# EAGLE design LED_Driver (EAGLE 7.2.0)
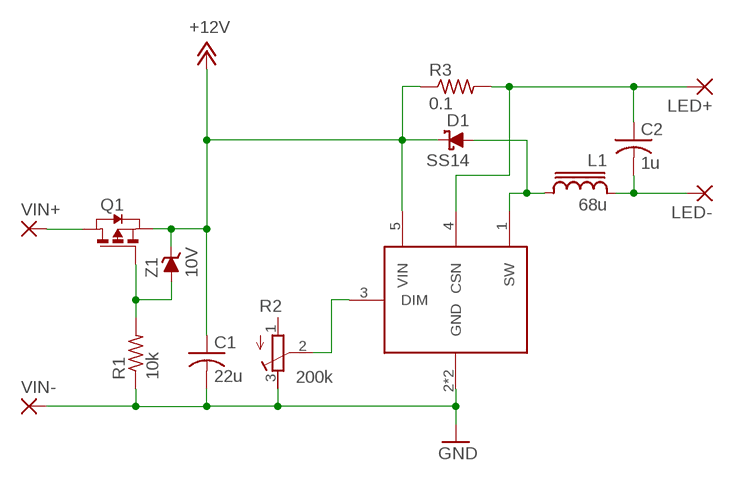
[diagram p0: schematic, sheet 1]

## Parts
C1  22u  C-USC1210K  [C1210K]
C2  1u  C-USC0805K  [C0805K]
D1  SS14  SCHOTTKYSCHOTTKY-DO214AC  [DO214AC]
IC1  PT4115  [SOT-89-5]
L1  68u  CDRH127/LD  [CDRH127/LD]
LED+  SMD2  [SMD1,27-2,54]
LED-  SMD2  [SMD1,27-2,54]
Q1  PMOSSOT23  [SOT-23]
R1  10k  R-US_R0805  [R0805]
R2  200k  R-TRIMM3296W  [RTRIM3296W]
R3  0.1  R-US_R2512  [R2512]
VIN+  SMD2  [SMD1,27-2,54]
VIN-  SMD2  [SMD1,27-2,54]
Z1  10V  ZENER  [SOD123]

## Nets
+12V: C1.1 D1.C IC1.5(VIN) Q1.2(S) R3.1 Z1.C
DIM: IC1.3(DIM) R2.2(S)
GND: C1.2 IC1.2(GND) IC1.EX(GND) R1.1 R2.3(E) VIN-.1(P)
N$1: C2.1 IC1.4(CSN) LED+.1(P) R3.2
N$2: D1.A IC1.1(SW) L1.2
N$3: Q1.1(D) VIN+.1(P)
N$4: C2.2 L1.1 LED-.1(P)
N$8: Q1.3(G) R1.2 Z1.A
Unconnected: R2.1(A)

## Library data of the parts
C1 C2 = resistor:C-US: CAPACITOR, American symbol
D1 = diode:SCHOTTKY
IC1 = IC:PT4115
L1 = Inductor:CDRH127/LD
LED+ LED- VIN+ VIN- = wirepad:SMD2: SMD PAD
Q1 = zetex:PMOSSOT23: MOS FET; OC_FARNELL: unknown; OC_NEWARK: unknown
R1 R3 = resistor:R-US_: RESISTOR, American symbol
R2 = rcl:R-TRIMM: Trimm resistor
Z1 = diode:ZENER

## Board
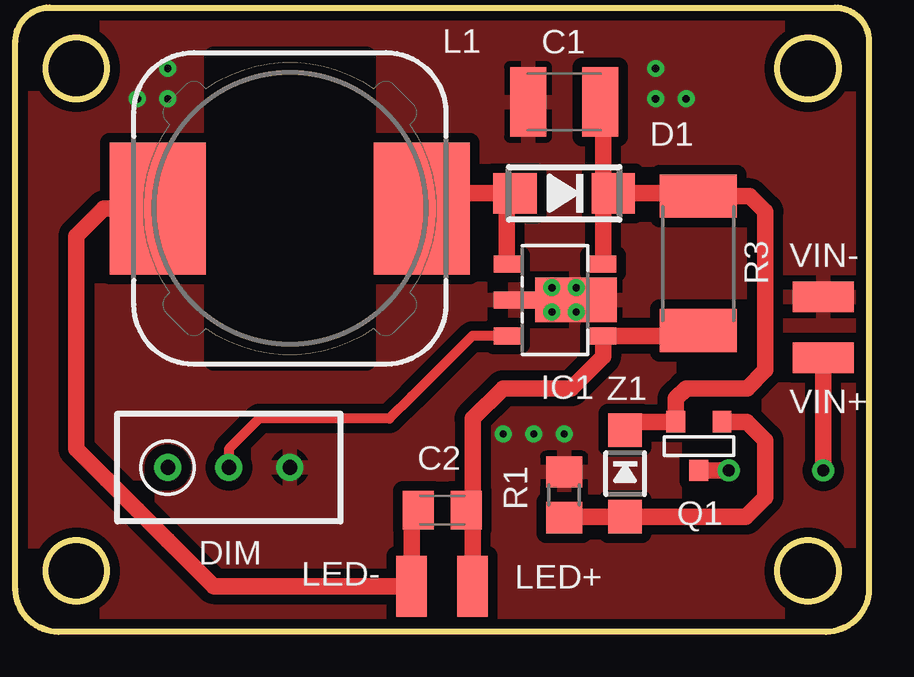
[diagram p1: board, top side]
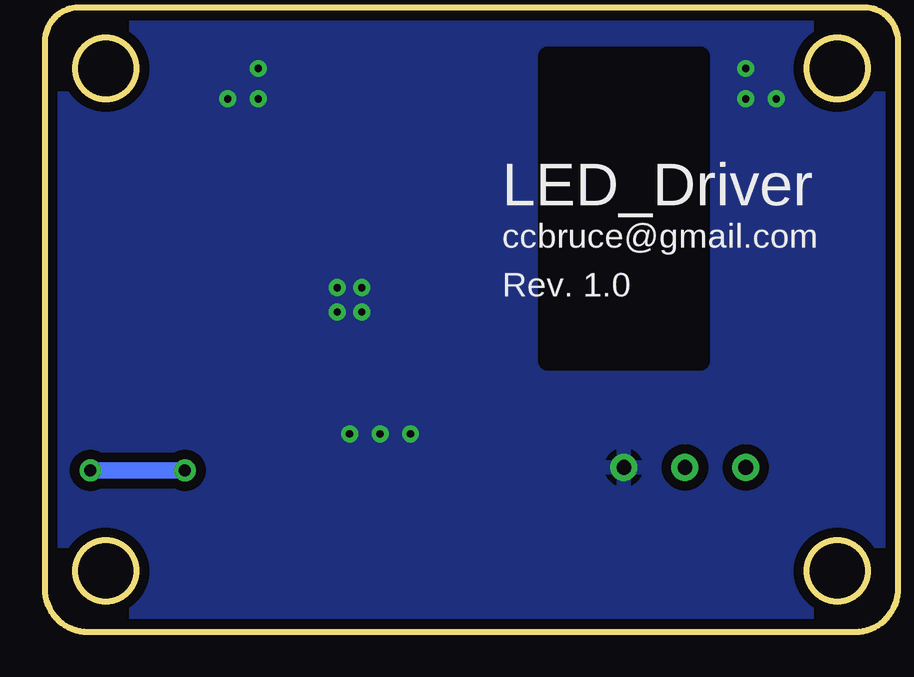
[diagram p2: board, bottom side, seen from below]

No outline drawn. Coordinates in mm, seen from the top.
Copper layers (1*16): Top 0.035mm / dielectric 1.5mm / Bottom 0.035mm
Design rules "default *": minimum track width 10mil, minimum drill 24mil, track to track 8mil, track to pad 8mil, pad to pad 8mil, via to via 8mil, smd to smd 8mil, copper to edge 40mil, drill to drill 8mil, minimum pad ring 10mil, minimum via ring 8mil, stop-mask expansion 4mil, vias tented up to drill 0.5mm, thermal gap 10mil
tRestrict: area 1.3,22.2 to 3.8,24.8; area 31.8,22.2 to 34.3,24.8; area 1.3,1.3 to 3.8,3.8; area 31.8,1.3 to 34.3,3.8; area 8.3,11.3 to 14.6,24; 8 lines
bRestrict: area 1.3,22.2 to 3.8,24.8; area 31.8,22.2 to 34.3,24.8; area 1.3,1.3 to 3.8,3.8; area 31.8,1.3 to 34.3,3.8; area 8.3,11.3 to 14.6,24; 8 lines
Milling: area 1.3,22.2 to 3.8,24.8; area 31.8,22.2 to 34.3,24.8; area 1.3,1.3 to 3.8,3.8; area 31.8,1.3 to 34.3,3.8; 8 lines

### Footprints (pad centres in the part's own frame; a part is rotated, then mirrored left to right if it is on the bottom)
C1210K = smd 1.5 x 2.9: 1 -1.5,0; 2 1.5,0
C0805K = smd 1.3 x 1.6: 1 -1,0; 2 1,0
DO214AC = smd 1.8 x 1.7: A 2.05,0; C -2.05,0
SOT-89-5 = smd 0.7 x 1.1: 1 -1.5,-2.385; 3 1.5,-2.385; 4 1.5,1.62; 5 -1.5,1.62 | smd 0.7 x 1.8: 2 0,-2.035 | smd 1.85 x 3.4: EX 0,0.5
CDRH127/LD = smd 4 x 5.5: 1 -5.5,0; 2 5.5,0
SMD1,27-2,54 = smd 1.27 x 2.54: 1 0,0
SOT-23 = smd 0.787 x 0.889: 1 0.025,-1.016; 2 -0.94,1.016; 3 0.991,1.016
R0805 = smd 1.3 x 1.5: 1 -0.95,0; 2 0.95,0
RTRIM3296W = drill 0.61: 1 0,-2.54; 2 0,0; 3 0,2.54
R2512 = smd 1.8 x 3.2: 1 -2.8,0; 2 2.8,0
SOD123 = smd 1.4 x 1.4: A 1.805,0; C -1.805,0

### Placement (x,y rotation side)
C1  22.86,22.1 180 top
C2  17.78,5.08 180 top
D1  22.86,18.29 180 top
IC1  22.86,13.84 270 top
L1  11.43,17.65 0 top
LED+  19.05,1.91 0 top
LED-  16.51,1.91 0 top
Q1  28.45,7.75 0 top
R1  22.86,5.71 270 top
R2  8.89,6.86 270 top
R3  28.45,15.37 270 top
VIN+  33.66,11.43 90 top
VIN-  33.66,13.97 90 top
Z1  25.4,6.6 270 top

### Tracks (layer width: path | path; a pad name or v marks a point on that pad's centre or on a via)
+12V
  Top 0.686: IC1.5 24.48,18.29 | 24.48,18.29 D1.C 28.45,18.29 R3.1 30.6,18.17 31.24,17.53 31.24,10.92 30.48,10.16 27.94,10.16 27.51,9.73 Q1.2 25.4,8.76 Z1.C | 24.48,18.29 24.48,22.1 C1.1
DIM
  Top 0.406: IC1.3 19.04,12.34 16.51,9.82 15.58,8.89 10.16,8.89 8.89,7.62 R2.2
GND  (via drill 0.3)
  other vias: 22.35,14.35 23.37,14.35 22.35,13.34 23.37,13.34 22.86,8.26 21.59,8.26 20.32,8.26 26.67,23.5 6.35,23.5 5.08,22.23 6.35,22.23 26.67,22.23 27.94,22.23
  pour Top (isolate 0.406): -1.27,27.94 36.83,27.94 36.83,-1.27 -1.27,-1.27
  pour Bottom (isolate 0.406): -1.27,27.94 36.83,27.94 36.83,-1.27 -1.27,-1.27
N$1
  Top 0.686: LED+.1 19.05,5.08 | R3.2 28.45,12.34 IC1.4 24.48,11.48 23.16,10.16 20.32,10.16 19.05,8.89 19.05,5.08 | 19.05,5.08 C2.1
N$2
  Top 0.686: IC1.1 20.48,18.29 D1.A 16.93,18.29 L1.2
N$3  (via drill 0.5)
  Top 0.686: v33.66,6.73 VIN+.1 | v29.72,6.73 Q1.1
  Bottom 0.686: v33.66,6.73 v29.72,6.73
N$4
  Top 0.686: L1.1 3.68,17.65 2.54,16.51 2.54,7.62 3.81,6.35 5.08,5.08 6.35,3.81 8.26,1.91 LED-.1 16.51,5.08 C2.2
N$8
  Top 0.686: R1.2 22.86,4.8 Z1.A 30.43,4.8 31.24,5.61 31.24,7.99 30.47,8.76 Q1.3

### Text on the board
tNames: DIM
bNames: LED_Driver | ccbruce@gmail.com | Rev. 1.0